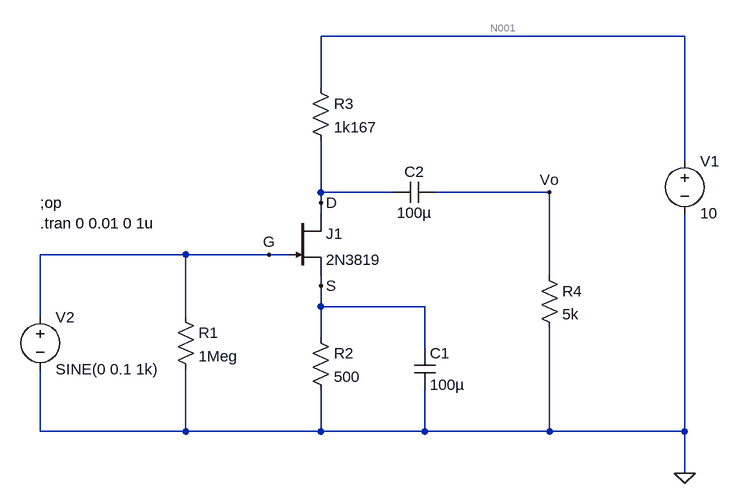
[diagram p0: schematic Experiment 10.asc]
Experiment 10.asc, the LTspice schematic file:
Version 4
SHEET 1 880 724
WIRE 784 32 224 32
WIRE 224 112 224 32
WIRE 784 224 784 32
WIRE 224 272 224 192
WIRE 336 272 224 272
WIRE 576 272 400 272
WIRE 224 288 224 272
WIRE 224 304 224 288
WIRE 16 368 -208 368
WIRE 144 368 16 368
WIRE 176 368 144 368
WIRE 576 400 576 272
WIRE 224 416 224 400
WIRE 224 448 224 416
WIRE 384 448 224 448
WIRE -208 464 -208 368
WIRE 16 464 16 368
WIRE 224 496 224 448
WIRE 384 512 384 448
WIRE -208 640 -208 544
WIRE 16 640 16 544
WIRE 16 640 -208 640
WIRE 224 640 224 576
WIRE 224 640 16 640
WIRE 384 640 384 576
WIRE 384 640 224 640
WIRE 576 640 576 480
WIRE 576 640 384 640
WIRE 784 640 784 304
WIRE 784 640 576 640
WIRE 784 704 784 640
FLAG 144 368 G
FLAG 224 288 D
FLAG 224 416 S
FLAG 784 704 0
FLAG 576 272 Vo
SYMBOL voltage 784 208 R0
WINDOW 123 0 0 Left 0
WINDOW 39 0 0 Left 0
SYMATTR InstName V1
SYMATTR Value 10
SYMBOL voltage -208 448 R0
WINDOW 123 0 0 Left 0
WINDOW 39 0 0 Left 0
SYMATTR InstName V2
SYMATTR Value SINE(0 0.1 1k)
SYMBOL res 0 448 R0
SYMATTR InstName R1
SYMATTR Value 1Meg
SYMBOL njf 176 304 R0
SYMATTR InstName J1
SYMATTR Value 2N3819
SYMBOL res 208 480 R0
SYMATTR InstName R2
SYMATTR Value 500
SYMBOL cap 368 512 R0
SYMATTR InstName C1
SYMATTR Value 100µ
SYMBOL res 208 96 R0
SYMATTR InstName R3
SYMATTR Value 1k167
SYMBOL res 560 384 R0
SYMATTR InstName R4
SYMATTR Value 5k
SYMBOL cap 336 288 R270
WINDOW 0 32 32 VTop 2
WINDOW 3 0 32 VBottom 2
SYMATTR InstName C2
SYMATTR Value 100µ
TEXT -208 288 Left 2 !;op
TEXT -208 320 Left 2 !.tran 0 0.01 0 1u

The netlist it stands for:
* Experiment 10.asc
V1 N001 0 10
V2 G 0 SINE(0 0.1 1k)
R1 G 0 1Meg
J1 D G S 2N3819
R2 S 0 500
C1 S 0 100µ
R3 N001 D 1k167
R4 Vo 0 5k
C2 D Vo 100µ
.model NJF NJF
.model PJF PJF
.lib standard.jft
;op
.tran 0 0.01 0 1u
.backanno
.end

* Results of the author's LTspice run, read from the files saved beside the schematic
* Operating Point, zero values left out:
*   V(n001) = 10 V
*   V(d) = 6.516 V
*   V(s) = 1.493 V
*   Id(J1) = 2.985 mA
*   Ig(J1) = -9.195 pA
*   Is(J1) = -2.985 mA
*   I(R3) = 2.985 mA
*   I(R2) = 2.985 mA
*   I(V2) = 9.195 pA
*   I(V1) = -2.985 mA
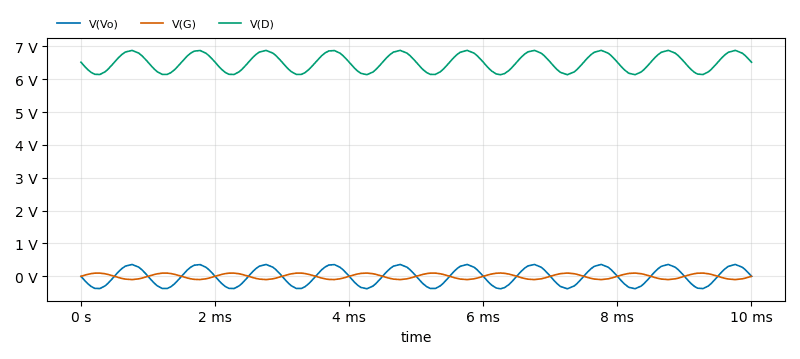
[diagram p1: Transient Analysis of Experiment 10.asc, plotted from the saved traces]
* Transient Analysis, 1 run:
*   V(Vo): min -380 mV, max 361.7 mV, average -3.849 mV, rms 259 mV, last 784.6 µV
*   V(G): min -99.75 mV, max 99.92 mV, average 243.7 µV, rms 69.69 mV, last 0 V
*   V(D): min 6.136 V, max 6.878 V, average 6.512 V, rms 6.518 V, last 6.517 V